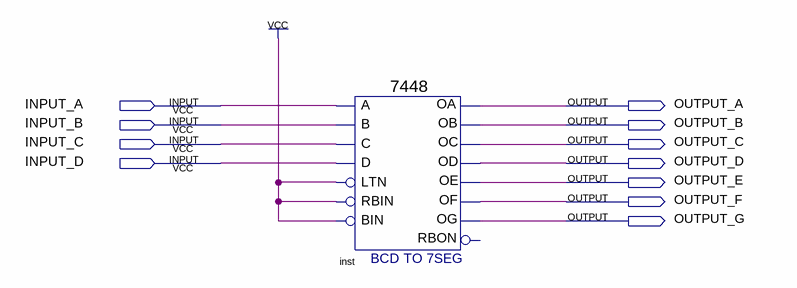
[diagram p0: schematic sheet]
// Quartus schematic YL_dec7748.bdf as structural Verilog: 1 symbols, 11 pins
module YL_dec7748 (
  input  INPUT_A,
  input  INPUT_B,
  input  INPUT_C,
  input  INPUT_D,
  output OUTPUT_A,
  output OUTPUT_B,
  output OUTPUT_C,
  output OUTPUT_D,
  output OUTPUT_E,
  output OUTPUT_F,
  output OUTPUT_G
);

  \7448  inst (
    .A(INPUT_A), .C(INPUT_C), .D(INPUT_D), .B(INPUT_B), .RBIN(1'b1), .BIN(1'b1), .LTN(1'b1), .OC(OUTPUT_C),
    .OE(OUTPUT_E), .OD(OUTPUT_D), .OF(OUTPUT_F), .OG(OUTPUT_G), .OB(OUTPUT_B), .OA(OUTPUT_A));  // open: RBON
endmodule
